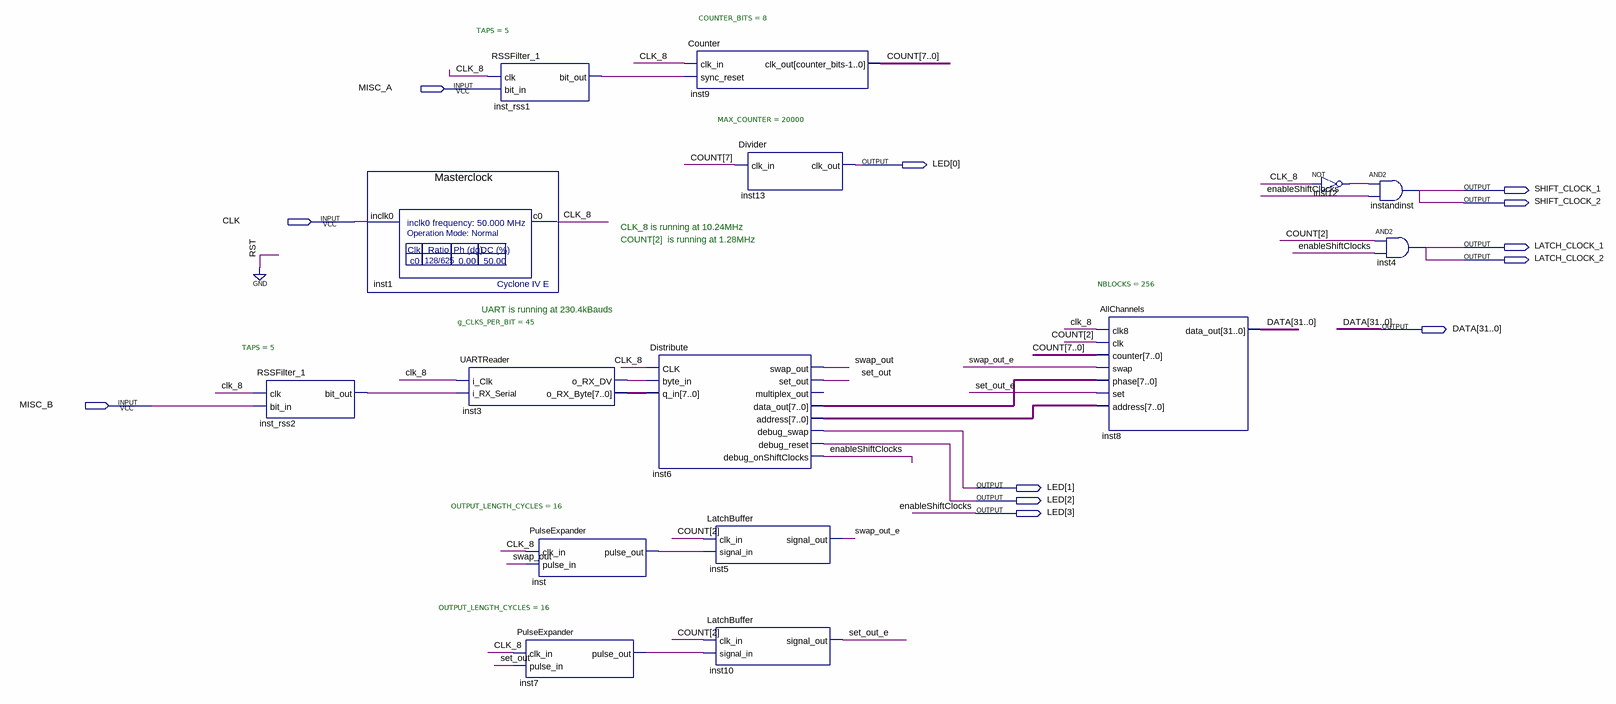
[diagram p0: schematic sheet]
// Quartus schematic QuadrupleBuffer.bdf as structural Verilog: 15 symbols, 12 pins
module QuadrupleBuffer (
  input  MISC_A,
  input  CLK,
  input  MISC_B,
  output [3:0] LED,
  output SHIFT_CLOCK_1,
  output SHIFT_CLOCK_2,
  output LATCH_CLOCK_1,
  output LATCH_CLOCK_2,
  output [31:0] DATA
);

  wire CLK_8, inst3_o_rx_dv, inst7_pulse_out, inst12_out, inst_pulse_out, inst_rss1_bit_out,
       inst_rss2_bit_out, set_out, set_out_e, swap_out, swap_out_e;
  wire [7:0] COUNT, inst3_o_rx_byte, inst6_address, inst6_data_out;

  RSSFilter_1 #(.TAPS(5)) inst_rss2 (.clk(CLK_8), .bit_in(MISC_B), .bit_out(inst_rss2_bit_out));
  Masterclock inst1 (.inclk0(CLK), .c0(CLK_8));
  UARTReader #(.g_CLKS_PER_BIT(45)) inst3 (
    .i_Clk(CLK_8), .i_RX_Serial(inst_rss2_bit_out), .o_RX_DV(inst3_o_rx_dv), .o_RX_Byte(inst3_o_rx_byte));
  RSSFilter_1 #(.TAPS(5)) inst_rss1 (.clk(CLK_8), .bit_in(MISC_A), .bit_out(inst_rss1_bit_out));
  PulseExpander #(.OUTPUT_LENGTH_CYCLES(16)) inst7 (.clk_in(CLK_8), .pulse_in(set_out), .pulse_out(inst7_pulse_out));
  PulseExpander #(.OUTPUT_LENGTH_CYCLES(16)) inst (.clk_in(CLK_8), .pulse_in(swap_out), .pulse_out(inst_pulse_out));
  Distribute inst6 (
    .CLK(CLK_8), .byte_in(inst3_o_rx_dv), .q_in(inst3_o_rx_byte), .swap_out(swap_out), .set_out(set_out),
    .data_out(inst6_data_out), .address(inst6_address), .debug_swap(LED[1]), .debug_reset(LED[2]),
    .debug_onShiftClocks(LED[3]));  // open: multiplex_out
  Counter #(.COUNTER_BITS(8)) inst9 (.clk_in(CLK_8), .sync_reset(inst_rss1_bit_out), .clk_out(COUNT));
  LatchBuffer inst5 (.clk_in(COUNT[2]), .signal_in(inst_pulse_out), .signal_out(swap_out_e));
  LatchBuffer inst10 (.clk_in(COUNT[2]), .signal_in(inst7_pulse_out), .signal_out(set_out_e));
  Divider #(.MAX_COUNTER(20000)) inst13 (.clk_in(COUNT[7]), .clk_out(LED[0]));
  AllChannels #(.NBLOCKS(256)) inst8 (
    .clk8(CLK_8), .clk(COUNT[2]), .counter(COUNT), .swap(swap_out_e), .phase(inst6_data_out),
    .set(set_out_e), .address(inst6_address), .data_out(DATA));
  not inst12 (inst12_out, CLK_8);
  and instandinst (SHIFT_CLOCK_1, inst12_out, LED[3]);
  and inst4 (LATCH_CLOCK_1, COUNT[2], LED[3]);

  assign LATCH_CLOCK_2 = LATCH_CLOCK_1;
  assign SHIFT_CLOCK_2 = SHIFT_CLOCK_1;

  // Other names for the same wires on the sheet: enableShiftClocks = LED[3]

  // Notes on the sheet:
  //   CLK_8 is running at 10.24MHz
  //   COUNT[2]  is running at 1.28MHz 
  //   UART is running at 230.4kBauds
endmodule
